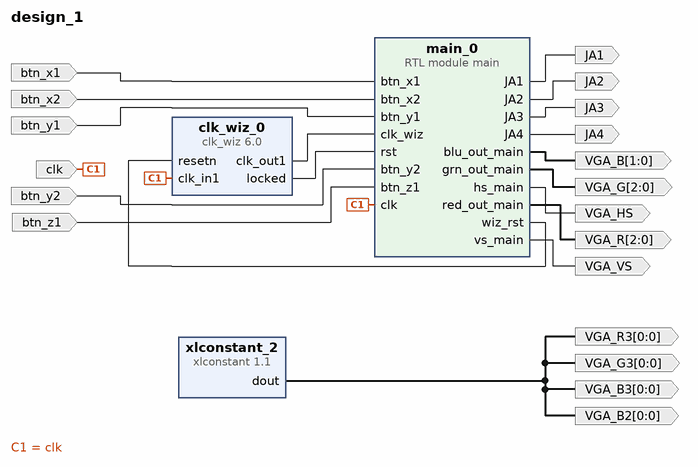
[diagram p0: block diagram of the top level]
# Vivado block design design_1, xc7z020clg484-1, Vivado 2018.3
create_bd_design design_1

create_bd_port -dir I -type clk clk
create_bd_port -dir O VGA_HS
create_bd_port -dir O VGA_VS
create_bd_port -dir O -from 2 -to 0 VGA_R
create_bd_port -dir O -from 2 -to 0 VGA_G
create_bd_port -dir O -from 1 -to 0 VGA_B
create_bd_port -dir O -from 0 -to 0 VGA_B2
create_bd_port -dir O -from 0 -to 0 VGA_B3
create_bd_port -dir O -from 0 -to 0 VGA_G3
create_bd_port -dir O -from 0 -to 0 VGA_R3
create_bd_port -dir I btn_x1
create_bd_port -dir I btn_x2
create_bd_port -dir I btn_y1
create_bd_port -dir I btn_z1
create_bd_port -dir I btn_y2
create_bd_port -dir O JA2
create_bd_port -dir O JA3
create_bd_port -dir O JA4
create_bd_port -dir O JA1

create_bd_cell -type ip -vlnv xilinx.com:ip:clk_wiz:6.0 clk_wiz_0
set_property -dict [list \
  CONFIG.CLKOUT1_JITTER 151.636 \
  CONFIG.CLKOUT1_PHASE_ERROR 98.575 \
  CONFIG.CLKOUT1_REQUESTED_OUT_FREQ 50 \
  CONFIG.MMCM_CLKFBOUT_MULT_F 10.000 \
  CONFIG.MMCM_CLKOUT0_DIVIDE_F 20.000 \
  CONFIG.MMCM_DIVCLK_DIVIDE 1 \
  CONFIG.RESET_PORT resetn \
  CONFIG.RESET_TYPE ACTIVE_LOW \
] [get_bd_cells clk_wiz_0]
create_bd_cell -type ip -vlnv xilinx.com:ip:xlconstant:1.1 xlconstant_2
set_property -dict {CONFIG.CONST_VAL 1 CONFIG.CONST_WIDTH 1} [get_bd_cells xlconstant_2]
create_bd_cell -type module -reference main main_0

# ---- connections ----

connect_bd_net [get_bd_ports clk] [get_bd_pins clk_wiz_0/clk_in1] [get_bd_pins main_0/clk]
connect_bd_net [get_bd_pins xlconstant_2/dout] [get_bd_ports VGA_B2] [get_bd_ports VGA_B3] [get_bd_ports VGA_G3] [get_bd_ports VGA_R3]
connect_bd_net -net btn_x1_1 [get_bd_ports btn_x1] [get_bd_pins main_0/btn_x1]
connect_bd_net -net btn_x2_1 [get_bd_ports btn_x2] [get_bd_pins main_0/btn_x2]
connect_bd_net -net btn_y1_1 [get_bd_ports btn_y1] [get_bd_pins main_0/btn_y1]
connect_bd_net -net btn_y2_1 [get_bd_ports btn_y2] [get_bd_pins main_0/btn_y2]
connect_bd_net -net btn_z1_1 [get_bd_ports btn_z1] [get_bd_pins main_0/btn_z1]
connect_bd_net [get_bd_pins main_0/wiz_rst] [get_bd_pins clk_wiz_0/resetn]
connect_bd_net [get_bd_pins clk_wiz_0/clk_out1] [get_bd_pins main_0/clk_wiz]
connect_bd_net [get_bd_pins clk_wiz_0/locked] [get_bd_pins main_0/rst]
connect_bd_net [get_bd_pins main_0/hs_main] [get_bd_ports VGA_HS]
connect_bd_net [get_bd_pins main_0/vs_main] [get_bd_ports VGA_VS]
connect_bd_net [get_bd_pins main_0/red_out_main] [get_bd_ports VGA_R]
connect_bd_net [get_bd_pins main_0/grn_out_main] [get_bd_ports VGA_G]
connect_bd_net [get_bd_pins main_0/blu_out_main] [get_bd_ports VGA_B]
connect_bd_net [get_bd_pins main_0/JA2] [get_bd_ports JA2]
connect_bd_net [get_bd_pins main_0/JA3] [get_bd_ports JA3]
connect_bd_net [get_bd_pins main_0/JA4] [get_bd_ports JA4]
connect_bd_net [get_bd_pins main_0/JA1] [get_bd_ports JA1]

validate_bd_design
save_bd_design
